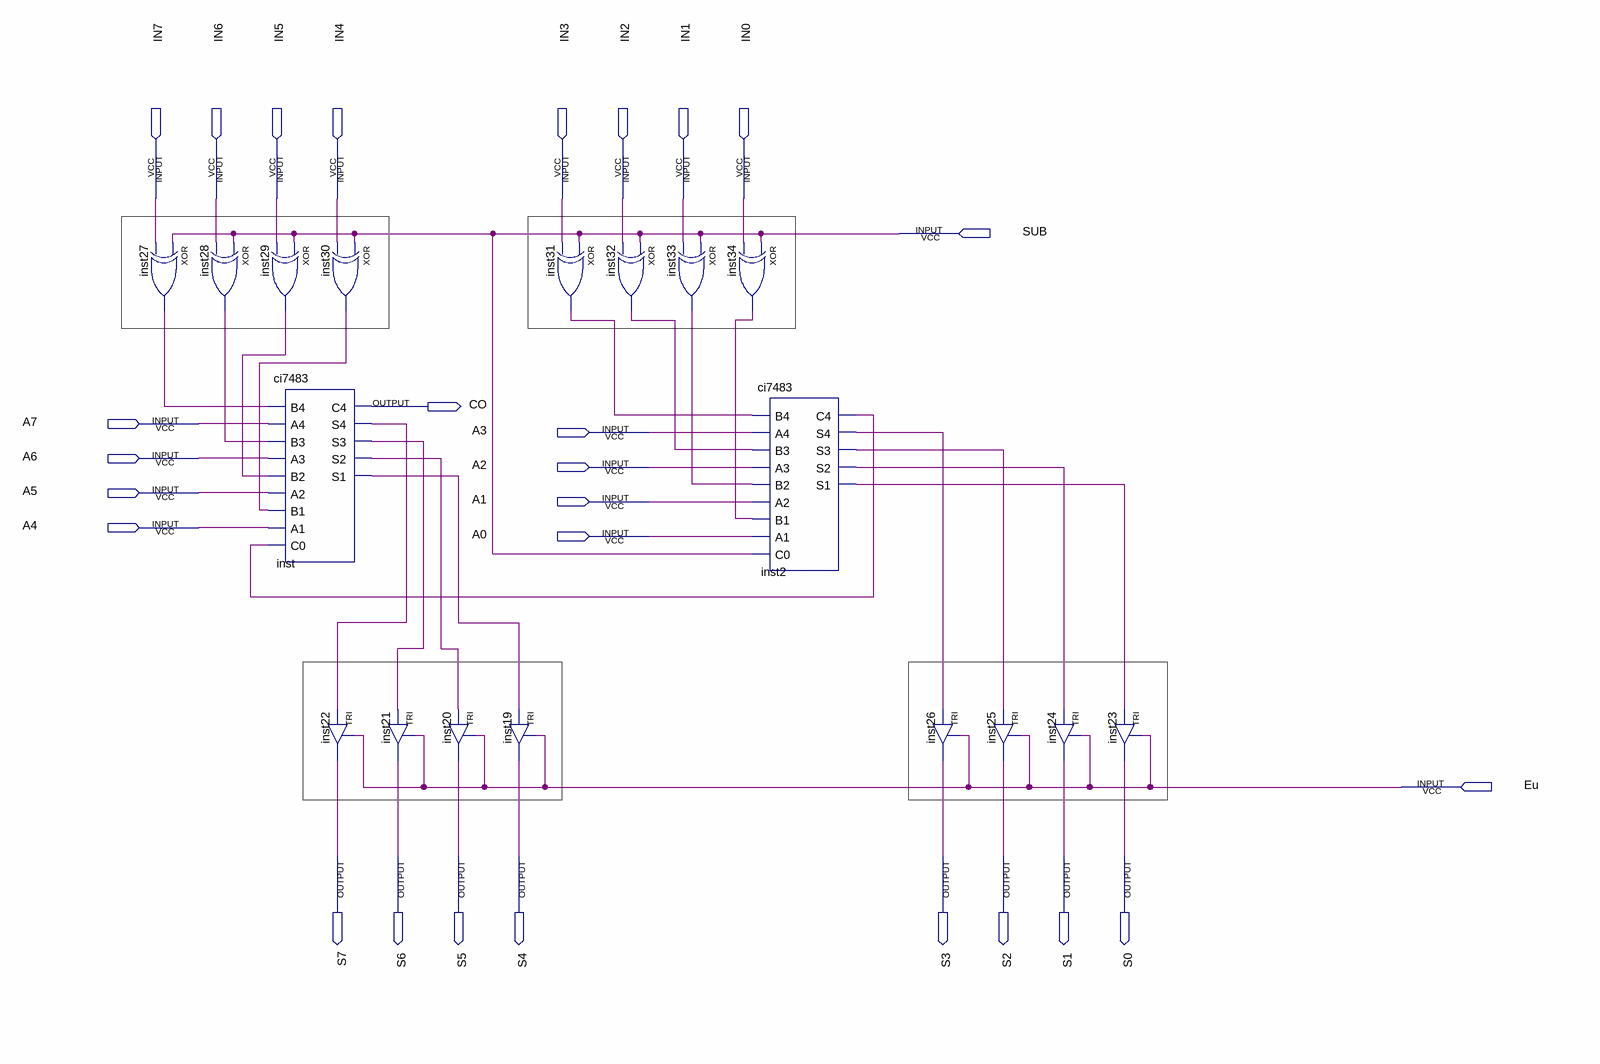
[diagram p0: schematic sheet]
// Quartus schematic SomadorSubtrator.bdf as structural Verilog: 18 symbols, 27 pins
module SomadorSubtrator (
  input  IN7,
  input  IN6,
  input  IN5,
  input  IN4,
  input  IN3,
  input  IN2,
  input  IN1,
  input  IN0,
  input  SUB,
  input  A7,
  input  A3,
  input  A6,
  input  A2,
  input  A5,
  input  A1,
  input  A4,
  input  A0,
  input  Eu,
  output CO,
  output S7,
  output S6,
  output S5,
  output S4,
  output S3,
  output S2,
  output S1,
  output S0
);

  wire inst2_c4, inst2_s1, inst2_s2, inst2_s3, inst2_s4, inst27_out, inst28_out, inst29_out, inst30_out,
       inst31_out, inst32_out, inst33_out, inst34_out, inst_s1, inst_s2, inst_s3, inst_s4;

  xor inst27 (inst27_out, SUB, IN7);
  xor inst28 (inst28_out, SUB, IN6);
  xor inst29 (inst29_out, SUB, IN5);
  ci7483 inst (
    .B4(inst27_out), .A4(A7), .B3(inst28_out), .A3(A6), .B2(inst29_out), .A2(A5), .B1(inst30_out), .A1(A4),
    .C0(inst2_c4), .C4(CO), .S4(inst_s4), .S3(inst_s3), .S2(inst_s2), .S1(inst_s1));
  xor inst30 (inst30_out, SUB, IN4);
  TRI inst21 (.IN(inst_s3), .OE(Eu), .OUT(S6));
  TRI inst22 (.IN(inst_s4), .OE(Eu), .OUT(S7));
  TRI inst20 (.IN(inst_s2), .OE(Eu), .OUT(S5));
  TRI inst19 (.IN(inst_s1), .OE(Eu), .OUT(S4));
  xor inst31 (inst31_out, SUB, IN3);
  xor inst32 (inst32_out, SUB, IN2);
  xor inst33 (inst33_out, SUB, IN1);
  xor inst34 (inst34_out, SUB, IN0);
  ci7483 inst2 (
    .B4(inst31_out), .A4(A3), .B3(inst32_out), .A3(A2), .B2(inst33_out), .A2(A1), .B1(inst34_out), .A1(A0),
    .C0(SUB), .C4(inst2_c4), .S4(inst2_s4), .S3(inst2_s3), .S2(inst2_s2), .S1(inst2_s1));
  TRI inst26 (.IN(inst2_s4), .OE(Eu), .OUT(S3));
  TRI inst25 (.IN(inst2_s3), .OE(Eu), .OUT(S2));
  TRI inst24 (.IN(inst2_s2), .OE(Eu), .OUT(S1));
  TRI inst23 (.IN(inst2_s1), .OE(Eu), .OUT(S0));
endmodule
